# Altium schematic sheet AIAO.SchDoc
size A3
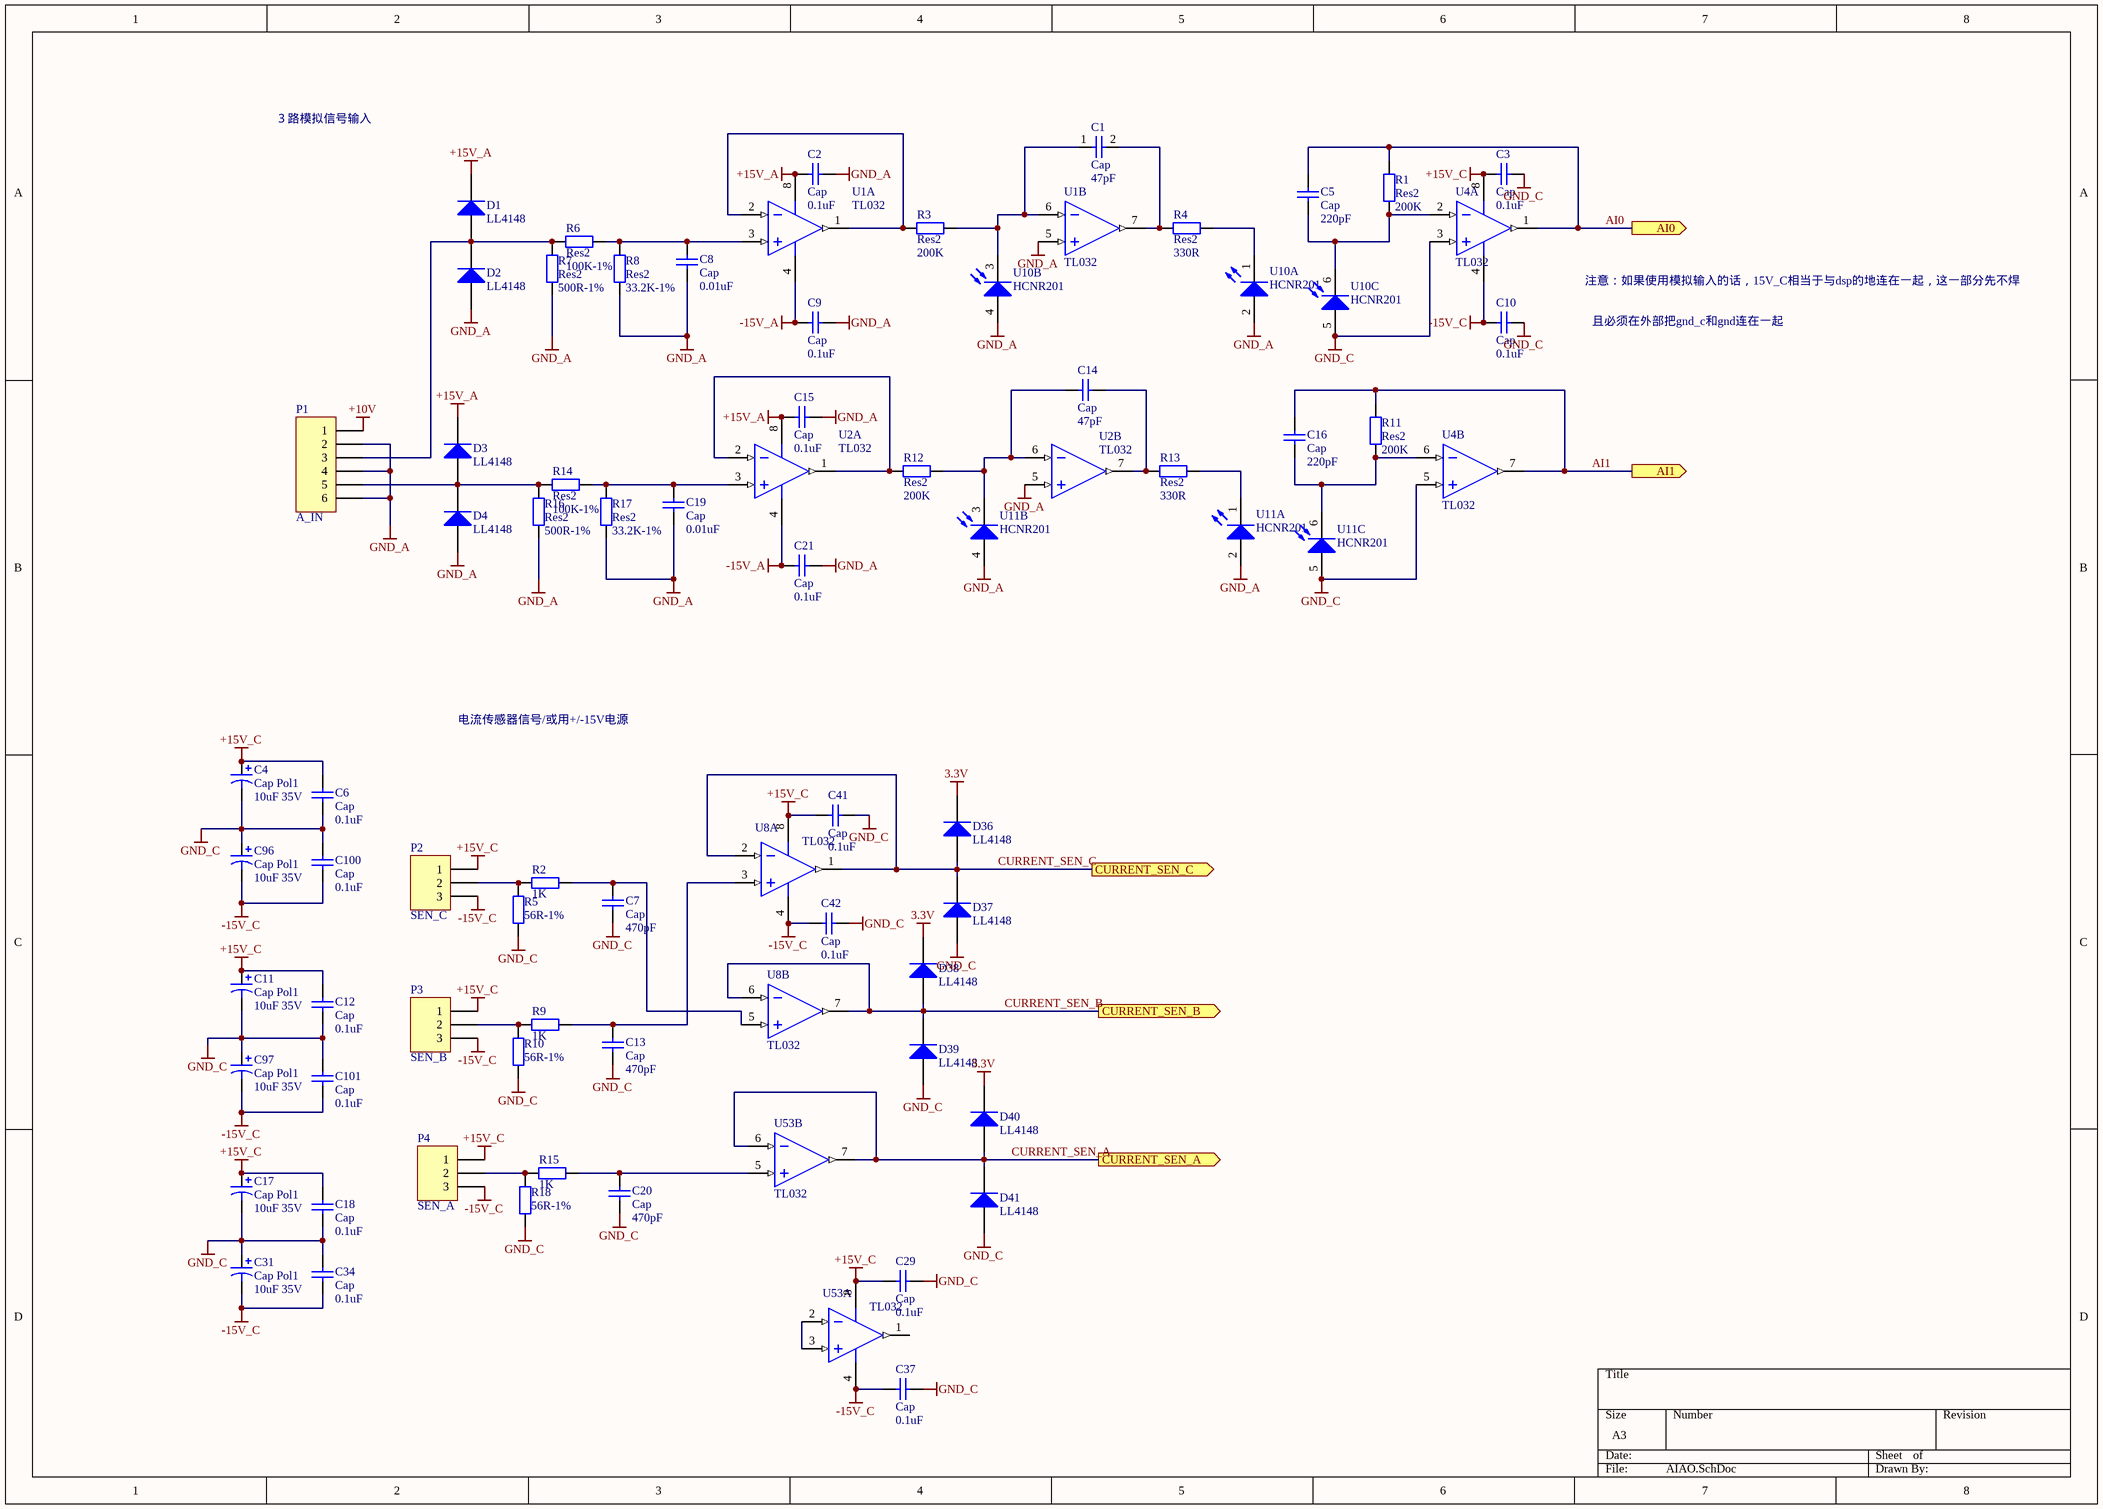
[diagram p0: AIAO.SchDoc]

## Parts
C1  Cap  value 47pF  [1206]
C2  Cap  value 0.1uF  [1206]
C3  Cap  value 0.1uF  [1206]
C4  Cap Pol1  value 10uF 35V  [1206]
C5  Cap  value 220pF  [1206]
C6  Cap  value 0.1uF  [1206]
C7  Cap  value 470pF  [1206]
C8  Cap  value 0.01uF  [1206]
C9  Cap  value 0.1uF  [1206]
C10  Cap  value 0.1uF  [1206]
C11  Cap Pol1  value 10uF 35V  [1206]
C12  Cap  value 0.1uF  [1206]
C13  Cap  value 470pF  [1206]
C14  Cap  value 47pF  [1206]
C15  Cap  value 0.1uF  [1206]
C16  Cap  value 220pF  [1206]
C17  Cap Pol1  value 10uF 35V  [1206]
C18  Cap  value 0.1uF  [1206]
C19  Cap  value 0.01uF  [1206]
C20  Cap  value 470pF  [1206]
C21  Cap  value 0.1uF  [1206]
C29  Cap  value 0.1uF  [1206]
C31  Cap Pol1  value 10uF 35V  [1206]
C34  Cap  value 0.1uF  [1206]
C37  Cap  value 0.1uF  [1206]
C41  Cap  value 0.1uF  [1206]
C42  Cap  value 0.1uF  [1206]
C96  Cap Pol1  value 10uF 35V  [1206]
C97  Cap Pol1  value 10uF 35V  [1206]
C100  Cap  value 0.1uF  [1206]
C101  Cap  value 0.1uF  [1206]
D1  LL4148  [SOD-80/MLL34]
D2  LL4148  [SOD-80/MLL34]
D3  LL4148  [SOD-80/MLL34]
D4  LL4148  [SOD-80/MLL34]
D36  LL4148  [SOD-80/MLL34]
D37  LL4148  [SOD-80/MLL34]
D38  LL4148  [SOD-80/MLL34]
D39  LL4148  [SOD-80/MLL34]
D40  LL4148  [SOD-80/MLL34]
D41  LL4148  [SOD-80/MLL34]
P1  A_IN  [phenox-6]
P2  SEN_C  [PHENOX-3]
P3  SEN_B  [PHENOX-3]
P4  SEN_A  [PHENOX-3]
R1  Res2  value 200K  [1206]
R2  value 1K  [1206]  (hidden comment: Res2)
R3  Res2  value 200K  [1206]
R4  Res2  value 330R  [1206]
R5  value 56R-1%  [1206]  (hidden comment: Res2)
R6  Res2  value 100K-1%  [1206]
R7  Res2  value 500R-1%  [1206]
R8  Res2  value 33.2K-1%  [1206]
R9  value 1K  [1206]  (hidden comment: Res2)
R10  value 56R-1%  [1206]  (hidden comment: Res2)
R11  Res2  value 200K  [1206]
R12  Res2  value 200K  [1206]
R13  Res2  value 330R  [1206]
R14  Res2  value 100K-1%  [1206]
R15  value 1K  [1206]  (hidden comment: Res2)
R16  Res2  value 500R-1%  [1206]
R17  Res2  value 33.2K-1%  [1206]
R18  value 56R-1%  [1206]  (hidden comment: Res2)
U1  TL032  [SO-8]  (parts A,B of 2)
U2  TL032  [SO-8]  (parts A,B of 2)
U4  TL032  [SO-8]  (parts A,B of 2)
U8  TL032  [SO-8]  (parts A,B of 2)
U10  HCNR201  [SOP254P1230X400-8N-2]  (parts A,B,C of 3)
U11  HCNR201  [SOP254P1230X400-8N-2]  (parts A,B,C of 3)
U53  TL032  [SO-8]  (parts A,B of 2)

## Ports
AI0 (out), AI1 (out), CURRENT_SEN_A (out), CURRENT_SEN_B (out), CURRENT_SEN_C (out)

## Nets
3.3V: D36.2(K) D38.2(K) D40.2(K)
+10V: P1.1
+15V_A: C2.1 C15.1 D1.2(K) D3.2(K) U1.8(V+) U2.8(V+)
+15V_C: C3.1 C4.1 C6.2 C11.1 C12.2 C17.1 C18.2 C29.2 C41.2 P2.1 P3.1 P4.1 U4.8(V+) U8.8(V+) U53.8(V+)
-15V_A: C9.1 C21.1 U1.4(V-) U2.4(V-)
-15V_C: C10.1 C31.2 C34.1 C37.2 C42.2 C96.2 C97.2 C100.1 C101.1 P2.3 P3.3 P4.3 U4.4(V-) U8.4(V-) U53.4(V-)
GND_A: C2.2 C8.1 C9.2 C15.2 C19.1 C21.2 D2.1(A) D4.1(A) P1.2 P1.4 P1.6 R7.1 R8.1 R16.1 R17.1 U1.5(IN+) U2.5(IN+) U10.2(A) U10.4(A) U11.2(A) U11.4(A)
GND_C: C3.2 C4.2 C6.1 C7.1 C10.2 C11.2 C12.1 C13.1 C17.2 C18.1 C20.1 C29.1 C31.1 C34.2 C37.1 C41.1 C42.1 C96.1 C97.1 C100.2 C101.2 D37.1(A) D39.1(A) D41.1(A) R5.1 R10.1 R18.1 U4.3(IN+) U4.5(IN+) U10.5(A) U11.5(A)
AI0: C5.2 R1.2 U4.1(OUT) ; port AI0
AI1: C16.2 R11.2 U4.7(OUT) ; port AI1
CURRENT_SEN_A: D40.1(A) D41.2(K) U53.6(IN-) U53.7(OUT) ; port CURRENT_SEN_A
CURRENT_SEN_B: D38.1(A) D39.2(K) U8.6(IN-) U8.7(OUT) ; port CURRENT_SEN_B
CURRENT_SEN_C: D36.1(A) D37.2(K) U8.1(OUT) U8.2(IN-) ; port CURRENT_SEN_C
NetC1_1: C1.1 R3.2 U1.6(IN-) U10.3(K)
NetC1_2: C1.2 R4.1 U1.7(OUT)
NetC5_1: C5.1 R1.1 U4.2(IN-) U10.6(K)
NetC7_2: C7.2 R2.2 U8.5(IN+)
NetC8_2: C8.2 R6.2 R8.2 U1.3(IN+)
NetC13_2: C13.2 R9.2 U8.3(IN+)
NetC14_1: C14.1 R12.2 U2.6(IN-) U11.3(K)
NetC14_2: C14.2 R13.1 U2.7(OUT)
NetC16_1: C16.1 R11.1 U4.6(IN-) U11.6(K)
NetC19_2: C19.2 R14.2 R17.2 U2.3(IN+)
NetC20_2: C20.2 R15.2 U53.5(IN+)
NetD1_1: D1.1(A) D2.2(K) P1.3 R6.1 R7.2
NetD3_1: D3.1(A) D4.2(K) P1.5 R14.1 R16.2
NetP2_2: P2.2 R2.1 R5.2
NetP3_2: P3.2 R9.1 R10.2
NetP4_2: P4.2 R15.1 R18.2
NetR3_1: R3.1 U1.1(OUT) U1.2(IN-)
NetR4_2: R4.2 U10.1(K)
NetR12_1: R12.1 U2.1(OUT) U2.2(IN-)
NetR13_2: R13.2 U11.1(K)
NetU53_2: U53.2(IN-) U53.3(IN+)

Not connected (* = marked no-connect by the designer): U53 1(OUT)

## Notes on the sheet
- ３路模拟信号输入
- 注意：如果使用模拟输入的话，15V_C相当于与dsp的地连在一起，这一部分先不焊
- 且必须在外部把gnd_c和gnd连在一起
- 电流传感器信号/或用+/-15V电源

## Library data of the parts
C1-C3 C5-C10 C12-C16 C18-C21 C29 C34 C37 C41 C42 C100 C101 = Cap: Capacitor; Published: 8-Jun-2000; LatestRevisionDate: 17-Jul-2002; LatestRevisionNote: Re-released for DXP Platform.; PackageReference: RAD-0.3; Publisher: Altium Limited
C4 C11 C17 C31 C96 C97 = Cap Pol1: Polarized Capacitor (Radial); Published: 8-Jun-2000; LatestRevisionDate: 17-Jul-2002; LatestRevisionNote: Re-released for DXP Platform.; PackageReference: RB7.6-15; Publisher: Altium Limited
D1-D4 = Diode 1N4148: High Conductance Fast Diode; Published: 8-Jun-2000; LatestRevisionDate: 17-Jul-2002; LatestRevisionNote: Re-released for DXP Platform.; DatasheetVersion: 1997; PackageReference: DO-35; Publisher: Altium Limited; Code_JEDEC: DO-204-AH; ComponentLink1Description: Manufacturer Link; ComponentLink1URL: http://www.fairchildsemi.com/; ComponentLink2Description: Datasheet; ComponentLink2URL: http://www.fairchildsemi.com/ds/1N%2F1N4148.pdf
D36-D41 = Diode 1N4007: 1 Amp General Purpose Rectifier; Published: 8-Jun-2000; LatestRevisionDate: 17-Jul-2002; LatestRevisionNote: Re-released for DXP Platform.; DatasheetVersion: 1998; PackageVersion: Aug-1999; PackageReference: DO-41; Publisher: Altium Limited; Code_JEDEC: DO-204-AL; ComponentLink1Description: Manufacturer Link; ComponentLink1URL: http://www.fairchildsemi.com/; ComponentLink2Description: Datasheet; ComponentLink2URL: http://www.fairchildsemi.com/ds/1N%2F1N4001.pdf
P1 = Header 6: Header, 6-Pin; LatestRevisionDate: 17-Jul-2002; LatestRevisionNote: Re-released for DXP Platform.; Publisher: Altium Limited
P2-P4 = Header 3: Header, 3-Pin; LatestRevisionDate: 17-Jul-2002; LatestRevisionNote: Re-released for DXP Platform.; Publisher: Altium Limited
R1-R18 = Res2: Resistor; Published: 8-Jun-2000; LatestRevisionDate: 17-Jul-2002; LatestRevisionNote: Re-released for DXP Platform.; PackageReference: AXIAL-0.4; Publisher: Altium Limited